# Altium schematic sheet PLC接线原理图.SchDoc
size A4
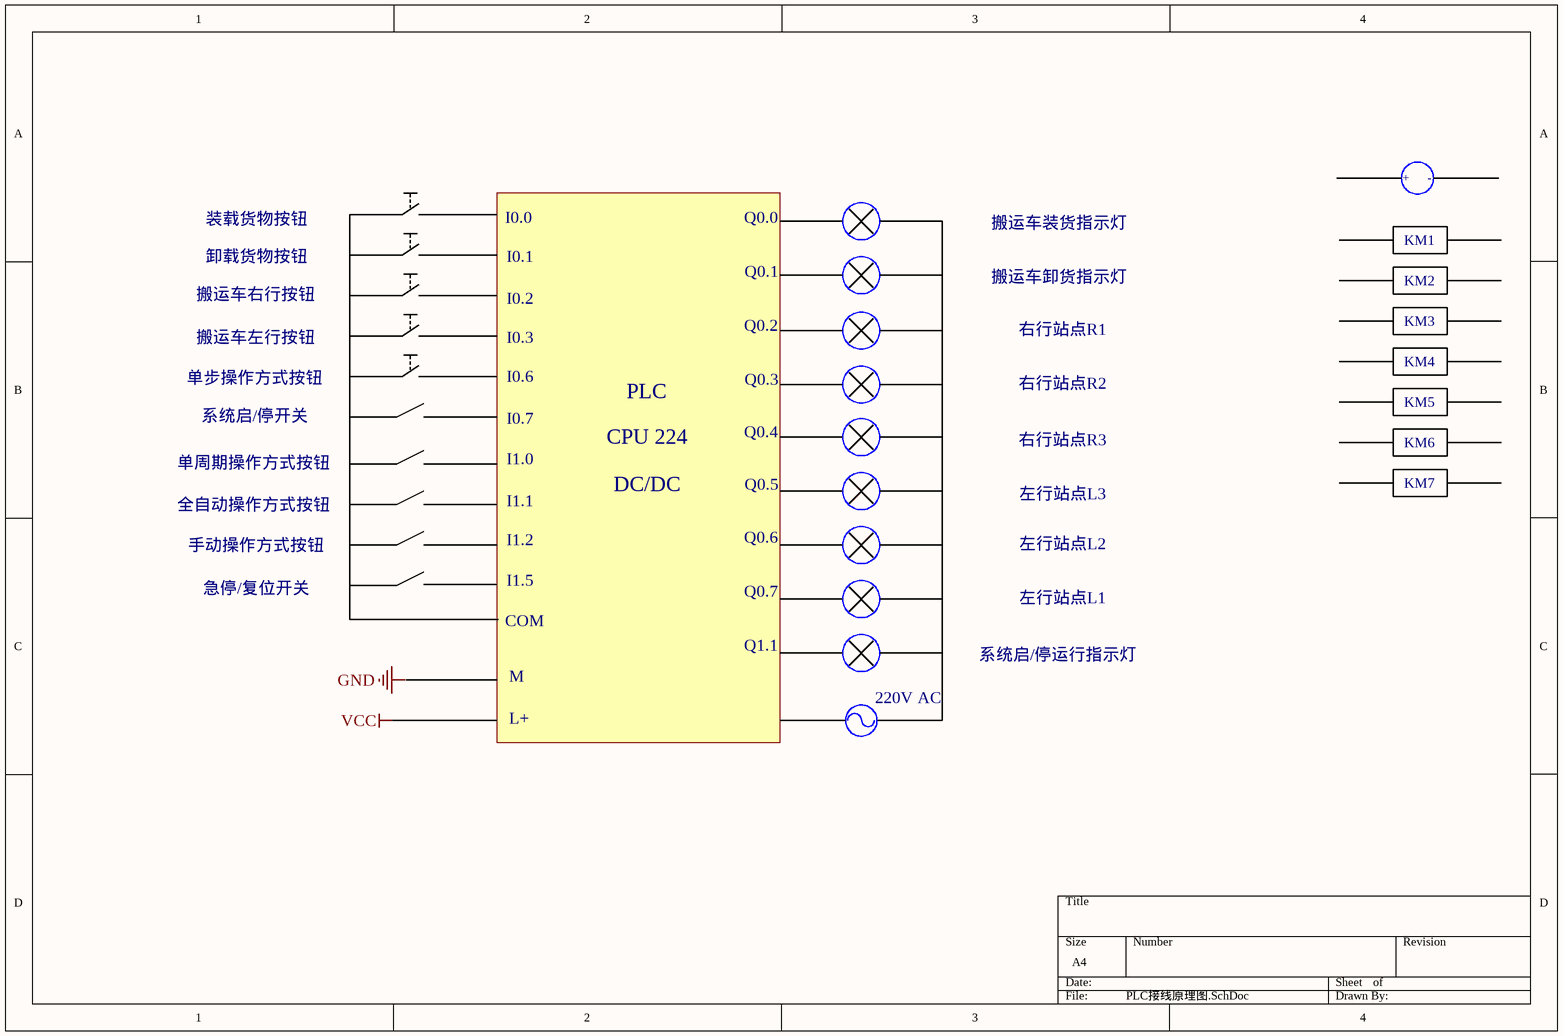
[diagram p0: PLC接线原理图.SchDoc]

## Notes on the sheet
- +      -
- 装载货物按钮
- I0.0
- Q0.0
- 搬运车装货指示灯
- KM1
- 搬运车右行按钮
- 卸载货物按钮
- I0.2
- I0.1
- Q0.1
- 搬运车卸货指示灯
- KM2
- KM3
- 单步操作方式按钮
- 搬运车左行按钮
- I0.6
- I0.3
- Q0.2
- Q0.3
- 右行站点R1
- KM4
- 系统启/停开关
- I0.7
- CPU 224
- PLC
- Q0.4
- 右行站点R2
- 右行站点R3
- KM5
- KM6
- 单周期操作方式按钮
- 全自动操作方式按钮
- I1.1
- I1.0
- DC/DC
- Q0.5
- 左行站点L3
- KM7
- 手动操作方式按钮
- I1.2
- I1.5
- Q0.6
- 左行站点L2
- 急停/复位开关
- COM
- Q1.1
- Q0.7
- 左行站点L1
- M
- 220V AC
- 系统启/停运行指示灯
- L+
- Labels drawn without touching a wire or pin: GND, VCC